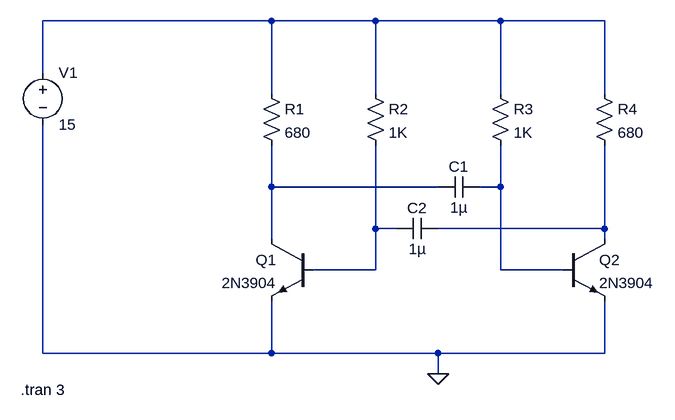
[diagram p0: schematic 1.asc]
1.asc, the LTspice schematic file:
Version 4
SHEET 1 880 680
WIRE -128 -304 -480 -304
WIRE 32 -304 -128 -304
WIRE 224 -304 32 -304
WIRE 384 -304 224 -304
WIRE -480 -224 -480 -304
WIRE -128 -192 -128 -304
WIRE 32 -192 32 -304
WIRE 224 -192 224 -304
WIRE 384 -192 384 -304
WIRE -128 -48 -128 -112
WIRE 128 -48 -128 -48
WIRE 224 -48 224 -112
WIRE 224 -48 192 -48
WIRE 32 16 32 -112
WIRE 64 16 32 16
WIRE 384 16 384 -112
WIRE 384 16 128 16
WIRE -128 32 -128 -48
WIRE 384 32 384 16
WIRE 32 80 32 16
WIRE 32 80 -64 80
WIRE 224 80 224 -48
WIRE 320 80 224 80
WIRE -480 208 -480 -144
WIRE -128 208 -128 128
WIRE -128 208 -480 208
WIRE 128 208 -128 208
WIRE 384 208 384 128
WIRE 384 208 128 208
WIRE 128 240 128 208
FLAG 128 240 0
SYMBOL npn -64 32 M0
SYMATTR InstName Q1
SYMATTR Value 2N3904
SYMBOL npn 320 32 R0
SYMATTR InstName Q2
SYMATTR Value 2N3904
SYMBOL res -144 -208 R0
SYMATTR InstName R1
SYMATTR Value 680
SYMATTR SpiceLine tol=5 pwr=0.25
SYMBOL res 16 -208 R0
SYMATTR InstName R2
SYMATTR Value 1K
SYMATTR SpiceLine tol=5 pwr=0.25
SYMBOL res 208 -208 R0
SYMATTR InstName R3
SYMATTR Value 1K
SYMATTR SpiceLine tol=5 pwr=0.25
SYMBOL res 368 -208 R0
SYMATTR InstName R4
SYMATTR Value 680
SYMATTR SpiceLine tol=5 pwr=0.25
SYMBOL voltage -480 -240 R0
WINDOW 123 0 0 Left 2
WINDOW 39 24 44 Left 2
SYMATTR InstName V1
SYMATTR Value 15
SYMBOL cap 192 -64 R90
WINDOW 0 0 32 VBottom 2
WINDOW 3 32 32 VTop 2
SYMATTR InstName C1
SYMATTR Value 1µ
SYMBOL cap 128 0 R90
WINDOW 0 0 32 VBottom 2
WINDOW 3 32 32 VTop 2
SYMATTR InstName C2
SYMATTR Value 1µ
TEXT -514 264 Left 2 !.tran 3

The netlist it stands for:
* 1.asc
Q1 N002 N004 0 0 2N3904
Q2 N005 N003 0 0 2N3904
R1 N001 N002 680 tol=5 pwr=0.25
R2 N001 N004 1K tol=5 pwr=0.25
R3 N001 N003 1K tol=5 pwr=0.25
R4 N001 N005 680 tol=5 pwr=0.25
V1 N001 0 15
C1 N003 N002 1µ
C2 N005 N004 1µ
.model NPN NPN
.model PNP PNP
.lib standard.bjt
.tran 3
.backanno
.end